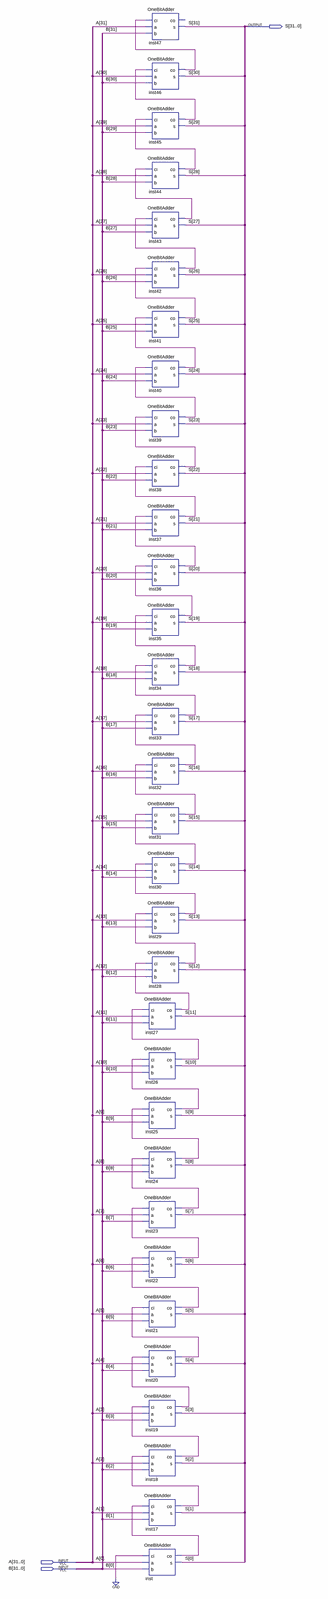
[diagram p0: schematic sheet, whole]
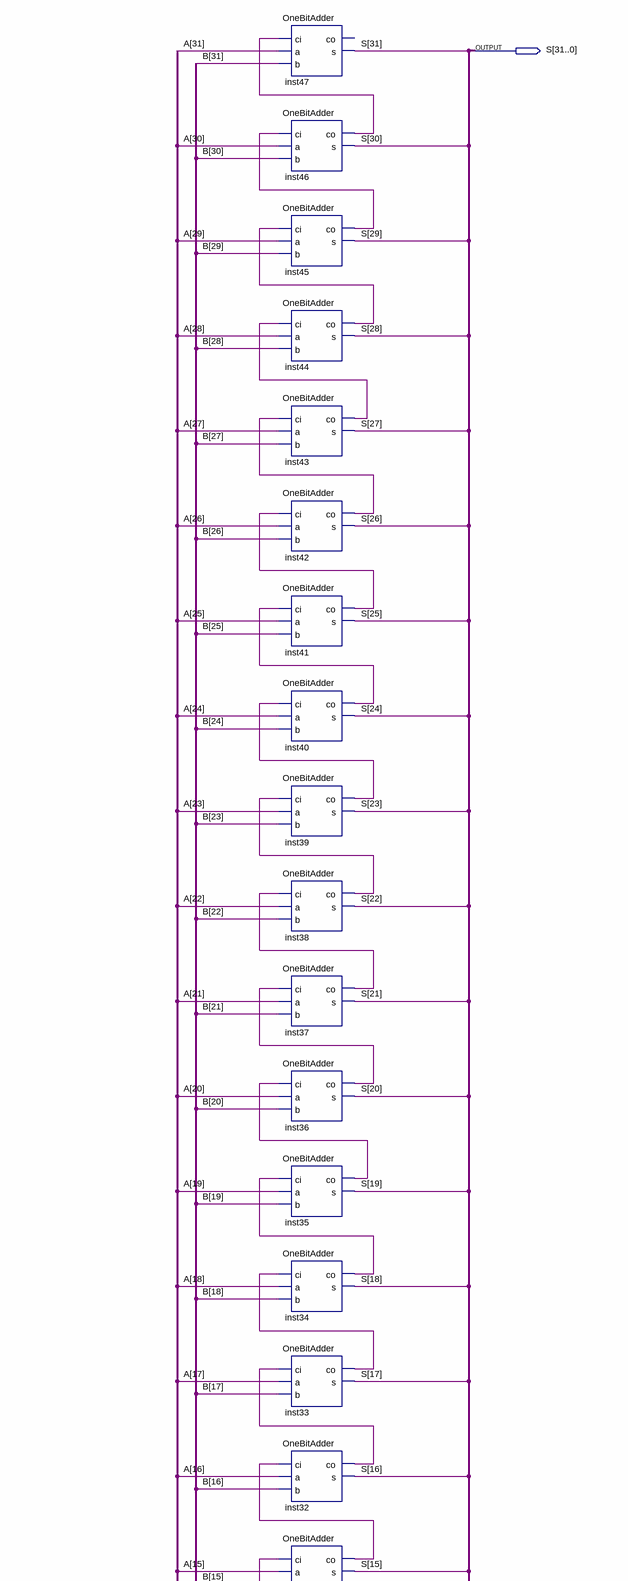
[diagram p1: schematic sheet, upper part]
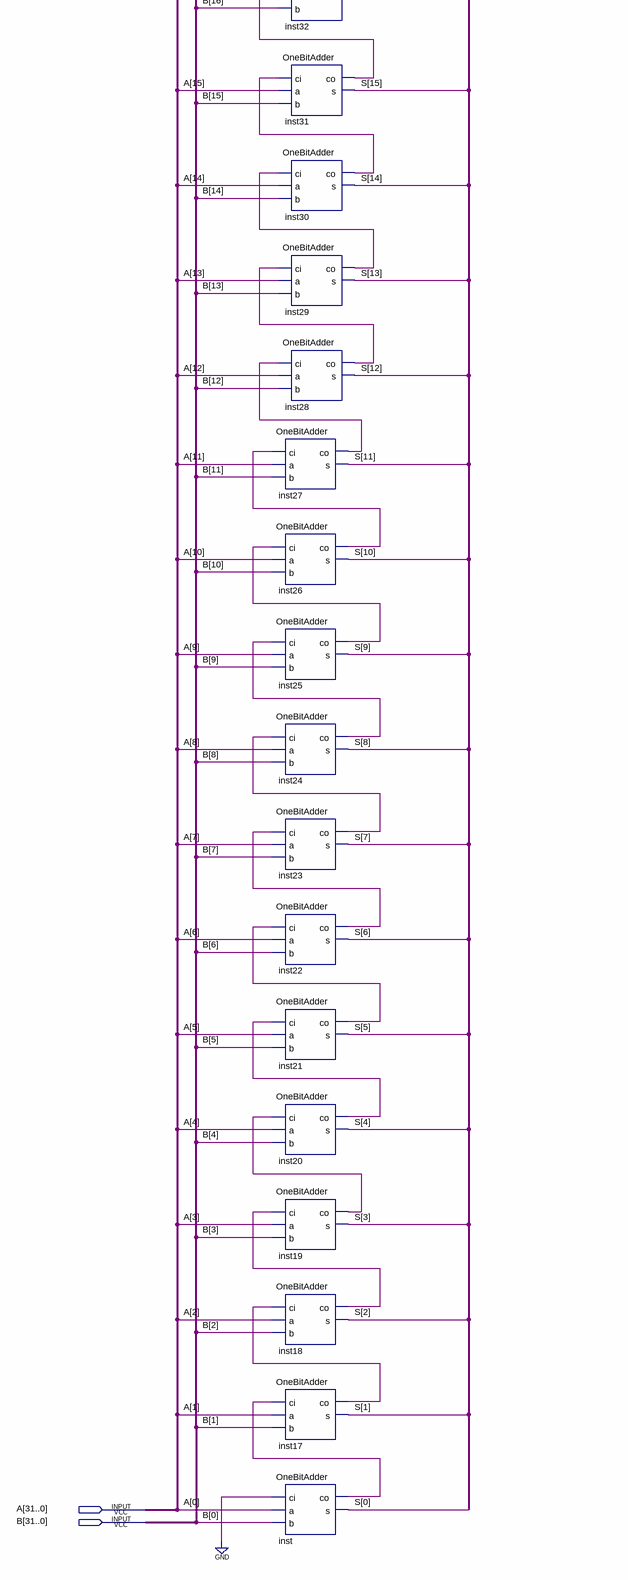
[diagram p2: schematic sheet, lower part]
// Quartus schematic Adder_32.bdf as structural Verilog: 32 symbols, 3 pins
module Adder_32 (
  input  [31:0] A,
  input  [31:0] B,
  output [31:0] S
);

  wire inst17_co, inst18_co, inst19_co, inst20_co, inst21_co, inst22_co, inst23_co, inst24_co, inst25_co,
       inst26_co, inst27_co, inst28_co, inst29_co, inst30_co, inst31_co, inst32_co, inst33_co, inst34_co,
       inst35_co, inst36_co, inst37_co, inst38_co, inst39_co, inst40_co, inst41_co, inst42_co, inst43_co,
       inst44_co, inst45_co, inst46_co, inst_co;

  OneBitAdder inst47 (.ci(inst46_co), .a(A[31]), .b(B[31]), .s(S[31]));  // open: co
  OneBitAdder inst46 (.ci(inst45_co), .a(A[30]), .b(B[30]), .co(inst46_co), .s(S[30]));
  OneBitAdder inst45 (.ci(inst44_co), .a(A[29]), .b(B[29]), .co(inst45_co), .s(S[29]));
  OneBitAdder inst44 (.ci(inst43_co), .a(A[28]), .b(B[28]), .co(inst44_co), .s(S[28]));
  OneBitAdder inst43 (.ci(inst42_co), .a(A[27]), .b(B[27]), .co(inst43_co), .s(S[27]));
  OneBitAdder inst42 (.ci(inst41_co), .a(A[26]), .b(B[26]), .co(inst42_co), .s(S[26]));
  OneBitAdder inst41 (.ci(inst40_co), .a(A[25]), .b(B[25]), .co(inst41_co), .s(S[25]));
  OneBitAdder inst40 (.ci(inst39_co), .a(A[24]), .b(B[24]), .co(inst40_co), .s(S[24]));
  OneBitAdder inst39 (.ci(inst38_co), .a(A[23]), .b(B[23]), .co(inst39_co), .s(S[23]));
  OneBitAdder inst38 (.ci(inst37_co), .a(A[22]), .b(B[22]), .co(inst38_co), .s(S[22]));
  OneBitAdder inst37 (.ci(inst36_co), .a(A[21]), .b(B[21]), .co(inst37_co), .s(S[21]));
  OneBitAdder inst36 (.ci(inst35_co), .a(A[20]), .b(B[20]), .co(inst36_co), .s(S[20]));
  OneBitAdder inst35 (.ci(inst34_co), .a(A[19]), .b(B[19]), .co(inst35_co), .s(S[19]));
  OneBitAdder inst34 (.ci(inst33_co), .a(A[18]), .b(B[18]), .co(inst34_co), .s(S[18]));
  OneBitAdder inst33 (.ci(inst32_co), .a(A[17]), .b(B[17]), .co(inst33_co), .s(S[17]));
  OneBitAdder inst32 (.ci(inst31_co), .a(A[16]), .b(B[16]), .co(inst32_co), .s(S[16]));
  OneBitAdder inst31 (.ci(inst30_co), .a(A[15]), .b(B[15]), .co(inst31_co), .s(S[15]));
  OneBitAdder inst30 (.ci(inst29_co), .a(A[14]), .b(B[14]), .co(inst30_co), .s(S[14]));
  OneBitAdder inst29 (.ci(inst28_co), .a(A[13]), .b(B[13]), .co(inst29_co), .s(S[13]));
  OneBitAdder inst28 (.ci(inst27_co), .a(A[12]), .b(B[12]), .co(inst28_co), .s(S[12]));
  OneBitAdder inst27 (.ci(inst26_co), .a(A[11]), .b(B[11]), .co(inst27_co), .s(S[11]));
  OneBitAdder inst26 (.ci(inst25_co), .a(A[10]), .b(B[10]), .co(inst26_co), .s(S[10]));
  OneBitAdder inst25 (.ci(inst24_co), .a(A[9]), .b(B[9]), .co(inst25_co), .s(S[9]));
  OneBitAdder inst24 (.ci(inst23_co), .a(A[8]), .b(B[8]), .co(inst24_co), .s(S[8]));
  OneBitAdder inst23 (.ci(inst22_co), .a(A[7]), .b(B[7]), .co(inst23_co), .s(S[7]));
  OneBitAdder inst22 (.ci(inst21_co), .a(A[6]), .b(B[6]), .co(inst22_co), .s(S[6]));
  OneBitAdder inst21 (.ci(inst20_co), .a(A[5]), .b(B[5]), .co(inst21_co), .s(S[5]));
  OneBitAdder inst20 (.ci(inst19_co), .a(A[4]), .b(B[4]), .co(inst20_co), .s(S[4]));
  OneBitAdder inst19 (.ci(inst18_co), .a(A[3]), .b(B[3]), .co(inst19_co), .s(S[3]));
  OneBitAdder inst18 (.ci(inst17_co), .a(A[2]), .b(B[2]), .co(inst18_co), .s(S[2]));
  OneBitAdder inst17 (.ci(inst_co), .a(A[1]), .b(B[1]), .co(inst17_co), .s(S[1]));
  OneBitAdder inst (.ci(1'b0), .a(A[0]), .b(B[0]), .co(inst_co), .s(S[0]));
endmodule
